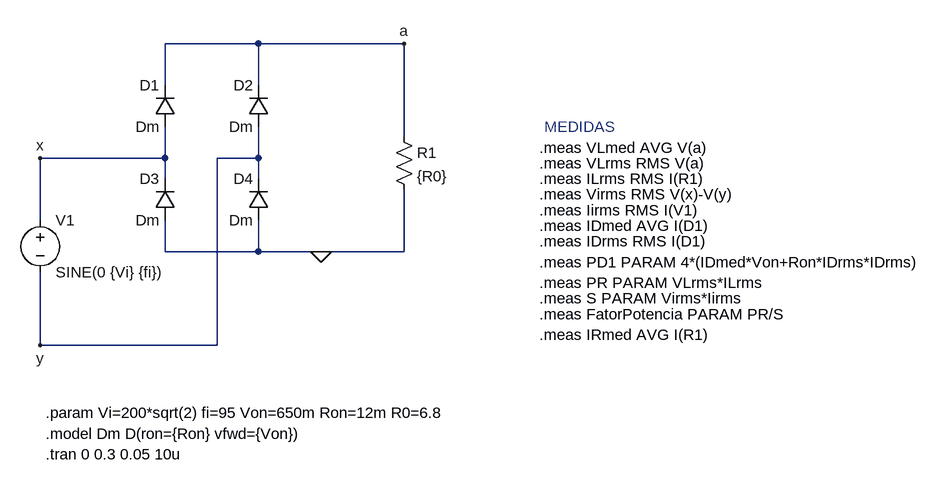
[diagram p0: schematic Q02-QUESTAO2.asc]
Q02-QUESTAO2.asc, the LTspice schematic file:
Version 4.1
SHEET 1 1432 680
WIRE 352 -192 208 -192
WIRE 576 -192 352 -192
WIRE 208 -128 208 -192
WIRE 352 -128 352 -192
WIRE 576 -48 576 -192
WIRE 208 -16 208 -64
WIRE 208 -16 16 -16
WIRE 352 -16 352 -64
WIRE 352 -16 288 -16
WIRE 208 16 208 -16
WIRE 352 16 352 -16
WIRE 16 80 16 -16
WIRE 208 128 208 80
WIRE 352 128 352 80
WIRE 352 128 208 128
WIRE 448 128 352 128
WIRE 576 128 576 32
WIRE 576 128 448 128
WIRE 16 272 16 160
WIRE 288 272 288 -16
WIRE 288 272 16 272
FLAG 448 128 0
FLAG 576 -192 a
FLAG 16 -16 x
FLAG 16 272 y
SYMBOL voltage 16 64 R0
WINDOW 123 0 0 Left 0
WINDOW 39 0 0 Left 0
SYMATTR InstName V1
SYMATTR Value SINE(0 {Vi} {fi})
SYMBOL diode 224 -64 R180
WINDOW 0 24 64 Left 2
WINDOW 3 24 0 Left 2
SYMATTR InstName D1
SYMATTR Value Dm
SYMBOL diode 368 -64 R180
WINDOW 0 24 64 Left 2
WINDOW 3 24 0 Left 2
SYMATTR InstName D2
SYMATTR Value Dm
SYMBOL diode 368 80 R180
WINDOW 0 24 64 Left 2
WINDOW 3 24 0 Left 2
SYMATTR InstName D4
SYMATTR Value Dm
SYMBOL diode 224 80 R180
WINDOW 0 24 64 Left 2
WINDOW 3 24 0 Left 2
SYMATTR InstName D3
SYMATTR Value Dm
SYMBOL res 560 -64 R0
SYMATTR InstName R1
SYMATTR Value {R0}
TEXT 24 376 Left 2 !.param Vi=200*sqrt(2) fi=95 Von=650m Ron=12m R0=6.8
TEXT 24 408 Left 2 !.model Dm D(ron={Ron} vfwd={Von})
TEXT 24 440 Left 2 !.tran 0 0.3 0.05 10u
TEXT 792 -64 Left 2 ;MEDIDAS
TEXT 784 -32 Left 2 !.meas VLmed AVG V(a)
TEXT 784 -8 Left 2 !.meas VLrms RMS V(a)
TEXT 784 16 Left 2 !.meas ILrms RMS I(R1)
TEXT 784 88 Left 2 !.meas IDmed AVG I(D1)
TEXT 784 112 Left 2 !.meas IDrms RMS I(D1)
TEXT 784 40 Left 2 !.meas Virms RMS V(x)-V(y)
TEXT 784 64 Left 2 !.meas Iirms RMS I(V1)
TEXT 784 144 Left 2 !.meas PD1 PARAM 4*(IDmed*Von+Ron*IDrms*IDrms)
TEXT 784 176 Left 2 !.meas PR PARAM VLrms*ILrms
TEXT 784 200 Left 2 !.meas S PARAM Virms*Iirms
TEXT 784 224 Left 2 !.meas FatorPotencia PARAM PR/S
TEXT 784 256 Left 2 !.meas IRmed AVG I(R1)

The netlist it stands for:
* Q02-QUESTAO2.asc
V1 x y SINE(0 {Vi} {fi})
D1 x a Dm
D2 y a Dm
D4 0 y Dm
D3 0 x Dm
R1 a 0 {R0}
.model D D
.lib standard.dio
.param Vi=200*sqrt(2) fi=95 Von=650m Ron=12m R0=6.8
.model Dm D(ron={Ron} vfwd={Von})
.tran 0 0.3 0.05 10u
* MEDIDAS
.meas VLmed AVG V(a)
.meas VLrms RMS V(a)
.meas ILrms RMS I(R1)
.meas IDmed AVG I(D1)
.meas IDrms RMS I(D1)
.meas Virms RMS V(x)-V(y)
.meas Iirms RMS I(V1)
.meas PD1 PARAM 4*(IDmed*Von+Ron*IDrms*IDrms)
.meas PR PARAM VLrms*ILrms
.meas S PARAM Virms*Iirms
.meas FatorPotencia PARAM PR/S
.meas IRmed AVG I(R1)
.backanno
.end